# EAGLE design Robottino_V2 (EAGLE 7.5.0)
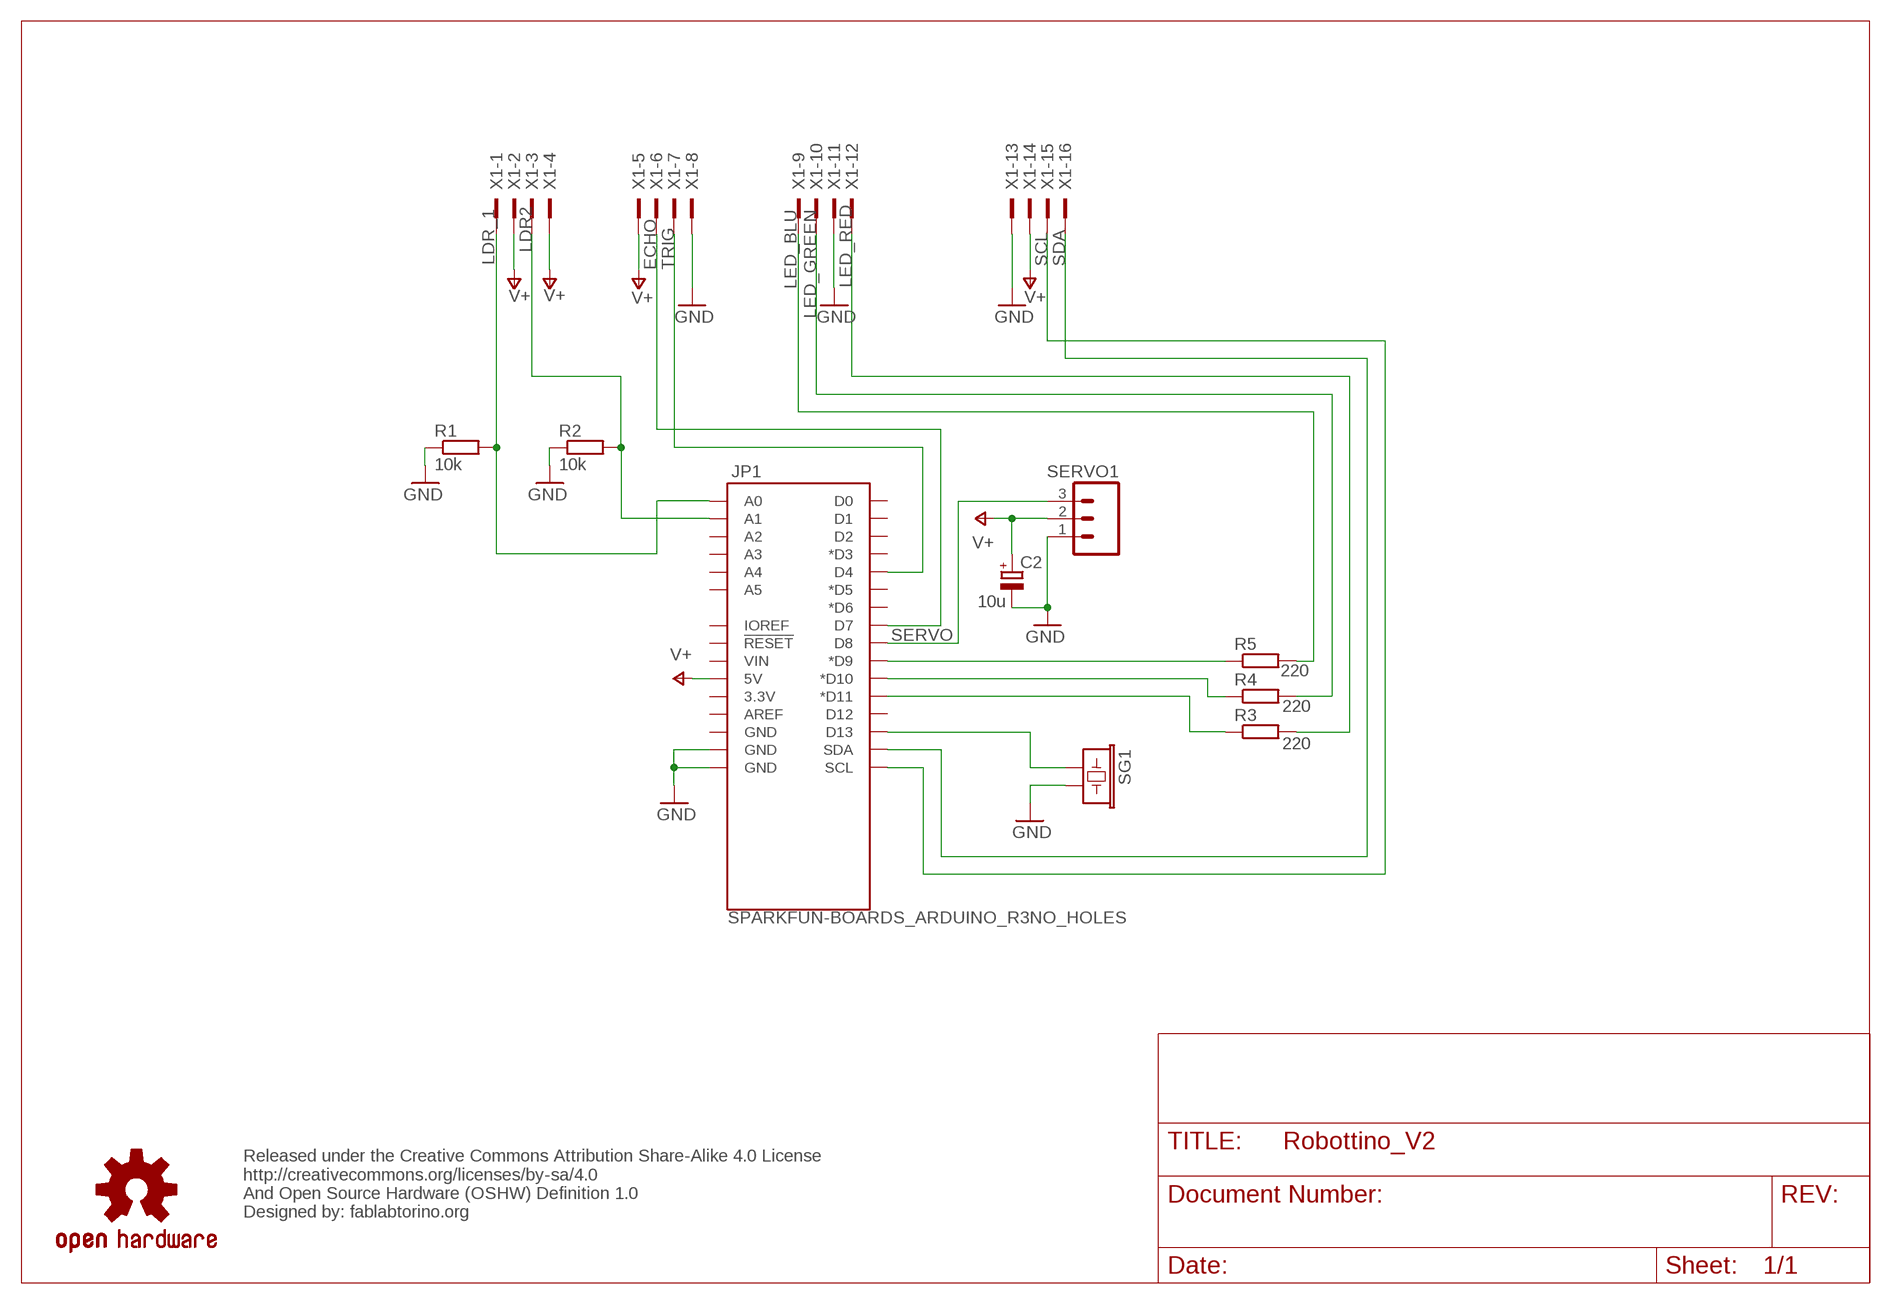
[diagram p0: schematic, sheet 1]

## Parts
C2  10u  CPOL-EUE2.5-6  [E2,5-6]
JP1  SPARKFUN-BOARDS_ARDUINO_R3NO_HOLES  [SPARKFUN-BOARDS_ARDUINO_R3_NO_HOLES]
LOGO1  OSHW-LOGOS  [OSHW-LOGO-S]
R1  10k  R-EU_0309/10  [0309/10]
R2  10k  R-EU_0309/10  [0309/10]
R3  220  R-EU_0309/10  [0309/10]
R4  220  R-EU_0309/10  [0309/10]
R5  220  R-EU_0309/10  [0309/10]
SERVO1  M03POLAR  [MOLEX-1X3]
SG1  SPARKFUN-ELECTROMECHANICAL_BUZZERPTH-NS-KIT  [SPARKFUN-ELECTROMECHANICAL_BUZZER-12MM-NS-KIT]
X1  2516-  [PAK100/2500-16]

## Nets
BUZZER: JP1.D13 SG1.+
ECHO: JP1.D4 X1.7
GND: C2.- JP1.GND@1(GND) JP1.GND@2(GND) R1.1 R2.1 SERVO1.1 SG1.- X1.8 X1.11 X1.13
LDR2: JP1.A1 R2.2 X1.3
LDR_1: JP1.A0 R1.2 X1.1
LED_BLU: R5.2 X1.9
LED_GREEN: R4.2 X1.10
LED_RED: R3.2 X1.12
N$1: JP1.D9(*D9) R5.1
N$32: JP1.D10(*D10) R4.1
R: JP1.D11(*D11) R3.1
SCL: JP1.SCL X1.15
SDA: JP1.SDA X1.16
SERVO: JP1.D8 SERVO1.3
TRIG: JP1.D7 X1.6
V+: C2.+ JP1.5V SERVO1.2 X1.2 X1.4 X1.5 X1.14
Unconnected: JP1.3.3V JP1.A2 JP1.A3 JP1.A4 JP1.A5 JP1.AREF JP1.D0 JP1.D1 JP1.D2 JP1.D3(*D3) JP1.D5(*D5) JP1.D6(*D6) JP1.D12 JP1.GND@3(GND) JP1.IOREF JP1.RESET@1(!RESET!) JP1.VIN

## Notes on the sheet
- Released under the Creative Commons Attribution Share-Alike 4.0 License
  http://creativecommons.org/licenses/by-sa/4.0
  And Open Source Hardware (OSHW) Definition 1.0
  Designed by: fablabtorino.org

## Library data of the parts
C2 = rcl:CPOL-EU: POLARIZED CAPACITOR, European symbol
JP1 = Robottino 2:SPARKFUN-BOARDS_ARDUINO_R3: Arduino R3 Footprint (w/ SPI header)
LOGO1 = SparkFun-Aesthetics:OSHW-LOGO: Open Source Hardware Logo This logo indicates the piece of hardware it is found on incorporates a OSHW license and/or adheres to the definition of open source hardware found here: http://freedomdefined.org/OSHW
R1-R5 = resistor:R-EU_: RESISTOR, European symbol
SERVO1 = SparkFun-Connectors:M03: Header 3 Standard 3-pin 0.1" header. Use with straight break away headers (SKU : PRT-00116), right angle break away headers (PRT-00553), swiss pins (PRT-00743), machine pins (PRT-00117), and female headers (PRT-00115). Molex polarized connector foot print use with SKU : PRT-08232 with associated crimp pins and housings.
SG1 = Robottino 2:SPARKFUN-ELECTROMECHANICAL_BUZZER: Buzzer 12mm Spark Fun Electronics SKU : Comp-Buzzer; PROD_ID: COMP-08253
X1 = con-3m:2516-: 3M (TM) Pak 100 4-Wall Header Source: 3M; OC_FARNELL: unknown; OC_NEWARK: unknown

## Board
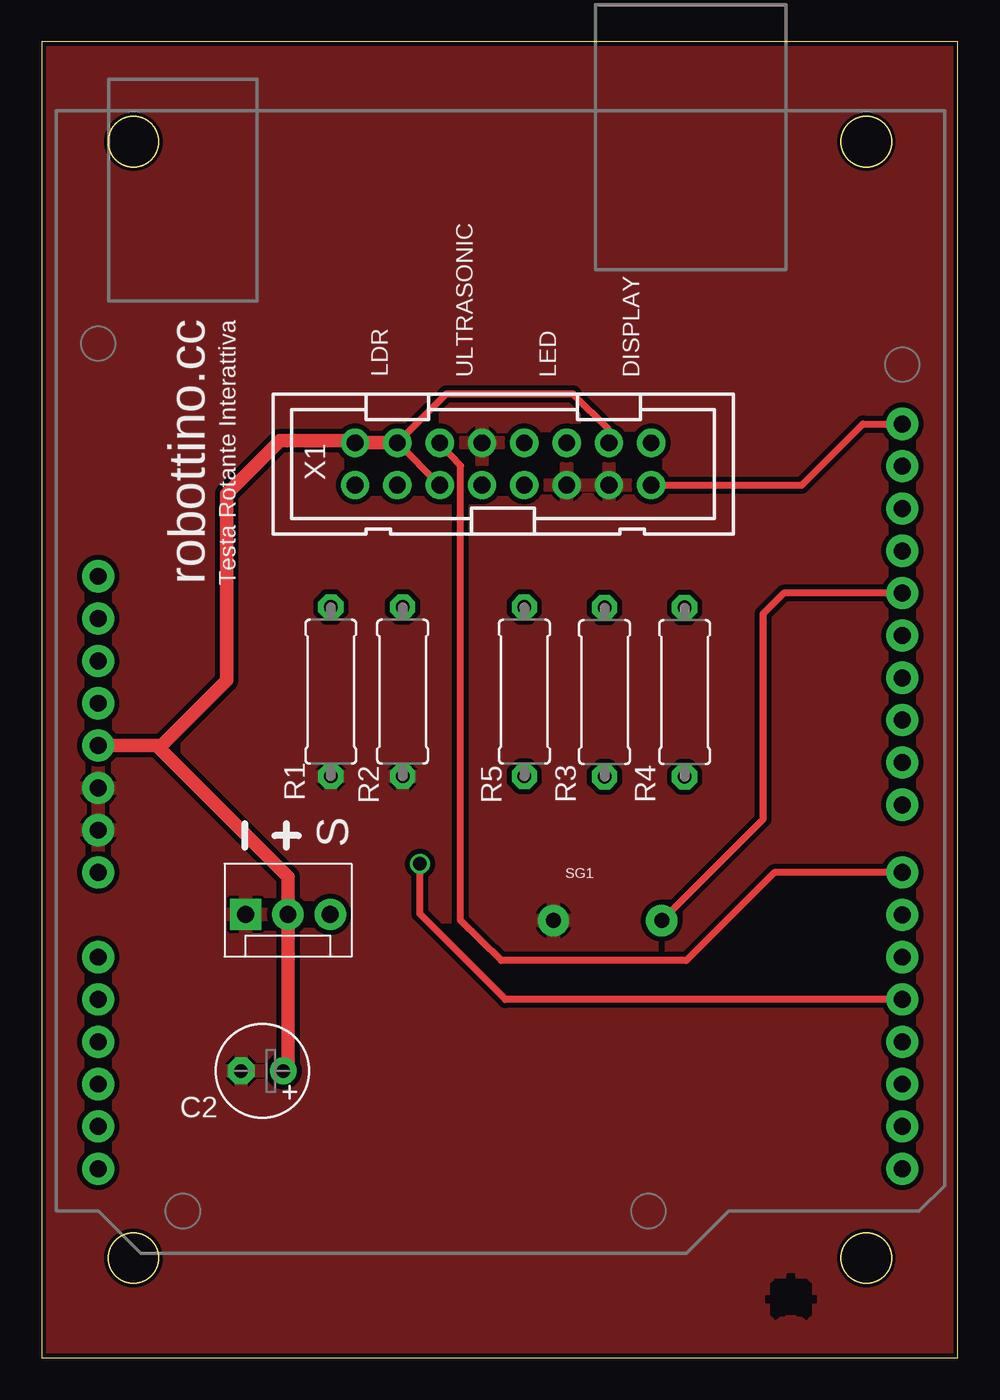
[diagram p1: board, top side]
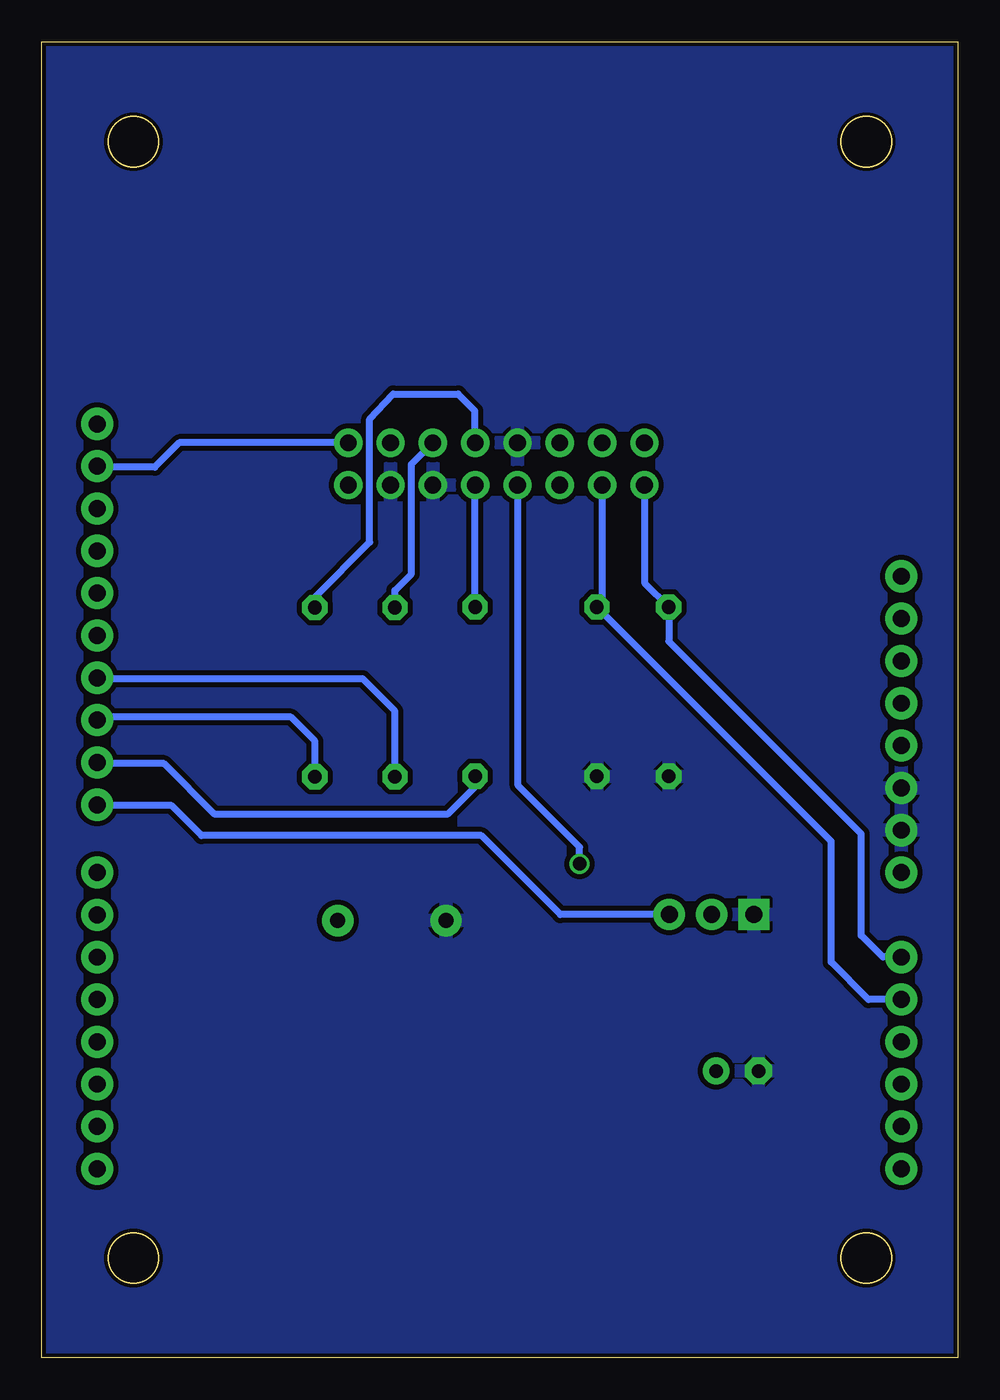
[diagram p2: board, bottom side, seen from below]

Size 55 x 79 mm. Coordinates in mm from the lower left corner, seen from the top.
Outline: 0,0 55,0 55,79 0,79 0,0
Outline: circle at 49.5,6 radius 1.5
Outline: circle at 5.5,6 radius 1.5
Outline: circle at 5.5,73 radius 1.5
Outline: circle at 49.5,73 radius 1.5
Copper layers (1*16): Top 0.018mm / dielectric 1.55mm / Bottom 0.018mm
Design rules "eC_2Layer_PClass6_BaseCopperO18_eCDefault *": minimum track width 0.15mm, minimum drill 0.35mm, track to track 0.3mm, track to pad 0.25mm, pad to pad 0.15mm, via to via 0.15mm, smd to smd 0mil, copper to edge 0.25mm, drill to drill 0.35mm, minimum pad ring 0.35mm, minimum via ring 0.125mm, stop-mask expansion 0mil, vias tented up to drill 0.45mm, thermal gap 0.2mm
Milling: area 48,4.5 to 51,7.5; area 4,4.5 to 7,7.5; area 4,71.5 to 7,74.5; area 48,71.5 to 51,74.5; 4 lines

### Footprints (pad centres in the part's own frame; a part is rotated, then mirrored left to right if it is on the bottom)
E2,5-6 = drill 0.813 pad 1.6: + -1.27,0 | drill 0.813 pad 1.6 octagon: - 1.27,0
SPARKFUN-BOARDS_ARDUINO_R3_NO_HOLES = drill 1.016 pad 1.93: 3.3V 35.56,2.54; 5V 38.1,2.54; A0 50.8,2.54; A1 53.34,2.54; A2 55.88,2.54; A3 58.42,2.54; A4 60.96,2.54; A5 63.5,2.54; AREF 23.876,50.8; D0 63.5,50.8; D1 60.96,50.8; D2 58.42,50.8; D3 55.88,50.8; D4 53.34,50.8; D5 50.8,50.8; D6 48.26,50.8; D7 45.72,50.8; D8 41.656,50.8; D9 39.116,50.8; D10 36.576,50.8; D11 34.036,50.8; D12 31.496,50.8; D13 28.956,50.8; GND@1 40.64,2.54; GND@2 43.18,2.54; GND@3 26.416,50.8; IOREF 30.48,2.54; NC 27.94,2.54; RESET@1 33.02,2.54; SCL 18.796,50.8; SDA 21.336,50.8; VIN 45.72,2.54
0309/10 = drill 0.813 octagon: 1 -5.08,0; 2 5.08,0
MOLEX-1X3 = drill 1.016 pad 1.88 square: 1 0,0 | drill 1.016 pad 1.88: 2 2.54,0; 3 5.08,0
SPARKFUN-ELECTROMECHANICAL_BUZZER-12MM-NS-KIT = drill 0.9 pad 1.88: + 3.25,0; - -3.25,0
PAK100/2500-16 = drill 1 pad 1.422: 1 -8.89,-1.27; 2 -8.89,1.27; 3 -6.35,-1.27; 4 -6.35,1.27; 5 -3.81,-1.27; 6 -3.81,1.27; 7 -1.27,-1.27; 8 -1.27,1.27; 9 1.27,-1.27; 10 1.27,1.27; 11 3.81,-1.27; 12 3.81,1.27; 13 6.35,-1.27; 14 6.35,1.27; 15 8.89,-1.27; 16 8.89,1.27

### Placement (x,y rotation side)
C2  13.24,17.22 180 top
E$1  [OSHW-LOGO-S_COPPER]  44.98,3.52 0 top
JP1  0.86,74.85 270 top
R1  17.36,39.98 90 top
R2  21.67,39.98 90 top
R3  33.79,39.95 90 top
R4  38.6,39.95 90 top
R5  28.98,39.98 90 top
SERVO1  12.24,26.61 0 top
SG1  33.97,26.25 0 top
X1  27.7,53.65 0 top

### Tracks (layer width: path | path; a pad name or v marks a point on that pad's centre or on a via)
BUZZER
  Top 0.406: JP1.D13 44.55,45.9 43.3,44.65 43.3,32.33 SG1.+
ECHO  (via drill 0.8)
  Top 0.406: JP1.D4 27.84,21.51 22.7,26.65 v22.7,29.65
  Bottom 0.406: v22.7,29.65 22.7,30.65 26.4,34.35 26.4,52.35 X1.7
GND
  pour Bottom: -1.1,80.35 55.9,80.35 55.9,-0.65 55.9,-1.65 -1.1,-1.65
  pour Top: -2.1,81.35 56.9,81.35 56.9,-2.65 -2.1,-2.65
LDR2
  Bottom 0.406: 21.75,45.14 R2.2 | X1.3 21.35,45.38 R2.2 | JP1.A1 5.36,21.51 7.6,23.75 7.6,31 R2.2 | 21.7,45.03 R2.2
LDR_1
  Bottom 0.406: X1.1 18.81,46.52 R1.2 17.36,43.01 5.8,31.45 5.8,25.35 4.5,24.05 JP1.A0
LED_BLU
  Bottom 0.406: R5.2 X1.9
LED_GREEN
  Bottom 0.406: R4.2 38.6,45.66 35.3,48.95 35.3,56.35 33.9,57.85 30,57.85 29,56.85 29,54.95 X1.10
LED_RED
  Bottom 0.406: X1.12 32.8,53.63 32.8,47.05 33.79,46.07 R3.2
N$1
  Bottom 0.406: R5.1 28.98,34.28 30.64,32.62 44.61,32.62 47.65,35.67 51.59,35.67 JP1.D9
N$32
  Bottom 0.406: R4.1 38.6,37.02 40.03,38.46 51.48,38.46 JP1.D10
R
  Bottom 0.406: R3.1 33.79,38.82 35.72,40.75 51.59,40.75 JP1.D11
SCL
  Top 0.406: X1.15 45.63,52.38 49.3,56.05 JP1.SCL
SDA
  Bottom 0.406: X1.16 46.73,54.92 48.2,53.45 51.6,53.45 JP1.SDA
SERVO
  Bottom 0.406: SERVO1.3 23.86,26.61 28.6,31.35 45.4,31.35 47.2,33.15 51.62,33.15 JP1.D8
TRIG
  Top 0.406: X1.6 23.89,54.86 25.15,53.55 25.15,26.25 27.6,23.85 38.7,23.85 43.98,29.13 JP1.D7
V+
  Top 0.406: X1.5 X1.4 24.28,57.85 31.9,57.85 34.05,55.7 X1.14
  Top 0.813: JP1.5V 6.9,36.75 | 6.9,36.75 7.2,36.75 11.1,40.65 11.1,51.85 14.3,55.05 18.68,55.05 X1.2 X1.4 | C2.+ 14.78,17.49 SERVO1.2 14.78,28.87 6.9,36.75

### Text on the board
tNames: LDR | ULTRASONIC | LED | DISPLAY | robottino.cc | Testa Rotante Interattiva | S
bStop: Robottino.cc | Testa Rotante Interattiva
Document: Released under the Creative Commons Attribution Share-Alike 4.0 License / http://creativecommons.org/licenses/by-sa/4.0 / And Open Source Hardware (OSHW) Definition 1.0 / Designed by: fablabtorino.org